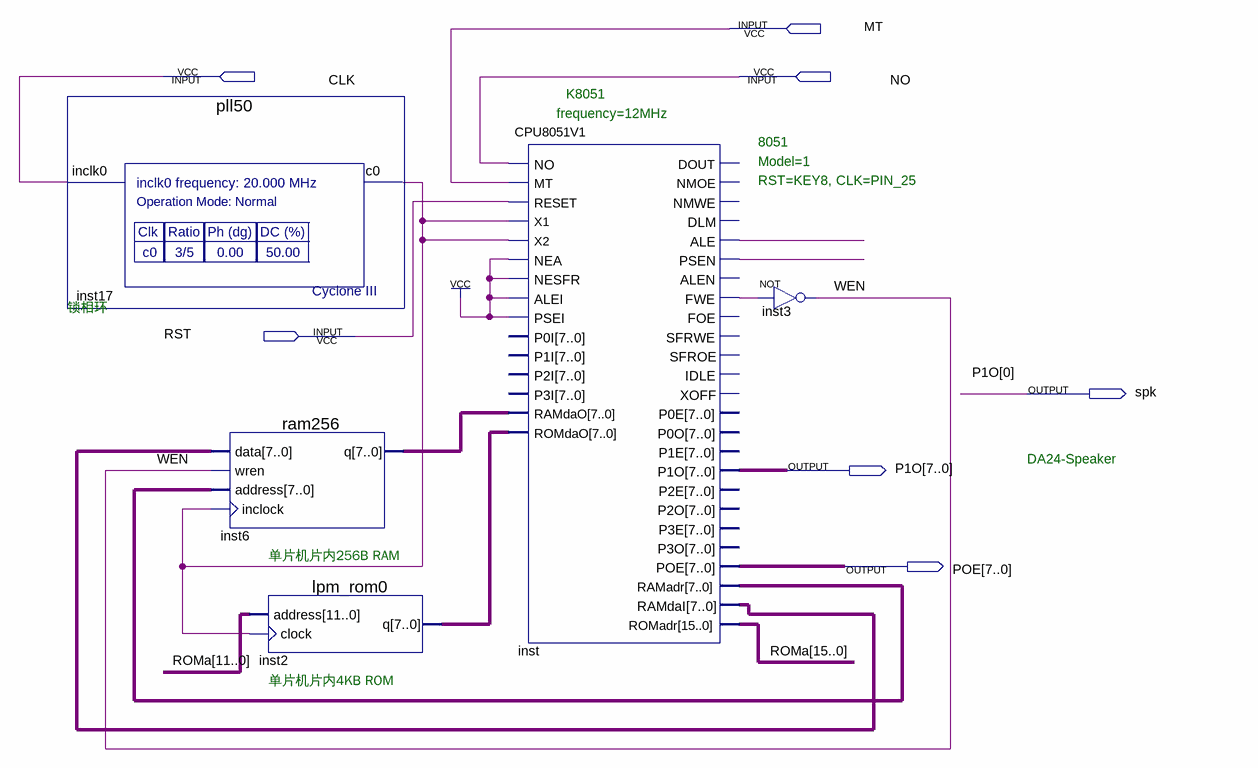
[diagram p0: schematic sheet]
// Quartus schematic MCU8951.bdf as structural Verilog: 5 symbols, 7 pins
module MCU8951 (
  input  MT,
  input  CLK,
  input  NO,
  input  RST,
  output spk,
  output [7:0] P1O,
  output [7:0] POE
);

  wire inst17_c0, inst_ale, inst_fwe, inst_psen, WEN;
  wire [7:0] inst2_q, inst6_q, inst_ramadr, inst_ramdai;
  wire [15:0] ROMa;

  pll50 inst17 (.inclk0(CLK), .c0(inst17_c0));
  ram256 inst6 (.data(inst_ramdai), .wren(WEN), .address(inst_ramadr), .inclock(inst17_c0), .q(inst6_q));
  lpm_rom0 inst2 (.address(ROMa[11:0]), .clock(inst17_c0), .q(inst2_q));
  CPU8051V1 inst (
    .NO(NO), .MT(MT), .RESET(RST), .X1(inst17_c0), .X2(inst17_c0), .NEA(1'b1), .NESFR(1'b1), .ALEI(1'b1),
    .PSEI(1'b1), .RAMdaO(inst6_q), .ROMdaO(inst2_q), .ALE(inst_ale), .PSEN(inst_psen), .FWE(inst_fwe),
    .P1O(P1O), .POE(POE), .RAMadr(inst_ramadr), .RAMdaI(inst_ramdai), .ROMadr(ROMa));  // open: P0I, P1I, P2I, P3I, DOUT, NMOE, NMWE, DLM, ALEN, FOE, SFRWE, SFROE, IDLE, XOFF, P0E, P0O, P1E, P2E, P2O, P3E, P3O
  not inst3 (WEN, inst_fwe);

  assign spk = P1O[0];

  // Notes on the sheet:
  //   K8051
  //   frequency=12MHz
  //   8051
  //   Model=1
  //   RST=KEY8, CLK=PIN_25
  //   锁相环
  //   DA24-Speaker
  //   单片机片内256B RAM
  //   单片机片内4KB ROM
endmodule
